# Altium schematic sheet Main.SchDoc
size A4; Author: Khanh BK; Organization: DB Bach Khoa HN; Address1: Bach Khoa- HBT - HN; Address2: khanh.db192932; Address3: Youtube: Đào Bá Khánh; Address4: 0357698570; Revision: 1.0Ver; SheetNumber: 1; SheetTotal: 9
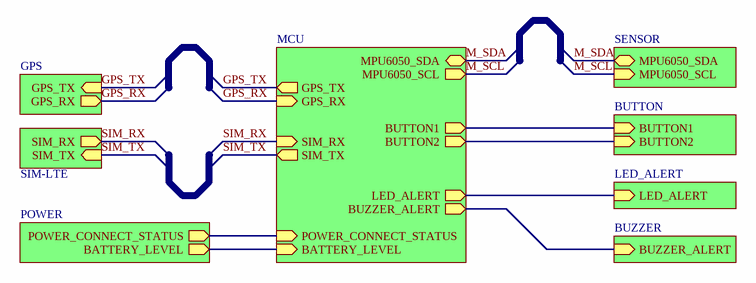
[diagram p0: Main.SchDoc]

## Sub-sheets
Designator = MCU: SIM_TX (out), SIM_RX (in), POWER_CONNECT_STATUS (in), LED_ALERT (out), MPU6050_SDA (bidir), GPS_TX (out), GPS_RX (in), BUZZER_ALERT (out), BATTERY_LEVEL (in), MPU6050_SCL (out), BUTTON2 (out), BUTTON1 (out)
Designator = SENSOR: MPU6050_SDA (bidir), MPU6050_SCL (in)
Designator = BUZZER: BUZZER_ALERT (in)
Designator = LED_ALERT: LED_ALERT (in)
Designator = POWER: BATTERY_LEVEL (out), POWER_CONNECT_STATUS (out)
Designator = GPS: GPS_TX (in), GPS_RX (out)
Designator = SIM-LTE: SIM_RX (out), SIM_TX (in)
Designator = BUTTON: BUTTON1 (in), BUTTON2 (in)

## Nets
GPS_RX: sheet Designator/GPS_RX, sheet Designator/GPS_RX
GPS_TX: sheet Designator/GPS_TX, sheet Designator/GPS_TX
M_SCL: sheet Designator/MPU6050_SCL, sheet Designator/MPU6050_SCL
M_SDA: sheet Designator/MPU6050_SDA, sheet Designator/MPU6050_SDA
SIM_RX: sheet Designator/SIM_RX, sheet Designator/SIM_RX
SIM_TX: sheet Designator/SIM_TX, sheet Designator/SIM_TX
(unnamed): sheet Designator/POWER_CONNECT_STATUS, sheet Designator/POWER_CONNECT_STATUS
(unnamed): sheet Designator/LED_ALERT, sheet Designator/LED_ALERT
(unnamed): sheet Designator/BUZZER_ALERT, sheet Designator/BUZZER_ALERT
(unnamed): sheet Designator/BATTERY_LEVEL, sheet Designator/BATTERY_LEVEL
(unnamed): sheet Designator/BUTTON2, sheet Designator/BUTTON2
(unnamed): sheet Designator/BUTTON1, sheet Designator/BUTTON1

## Notes on the sheet
- Title
- Size:
- Date:
- Author:
- A4
- Time:
- Number:
- Checked:
- Revision:
- Sheet
- Approved:
- of
- File: